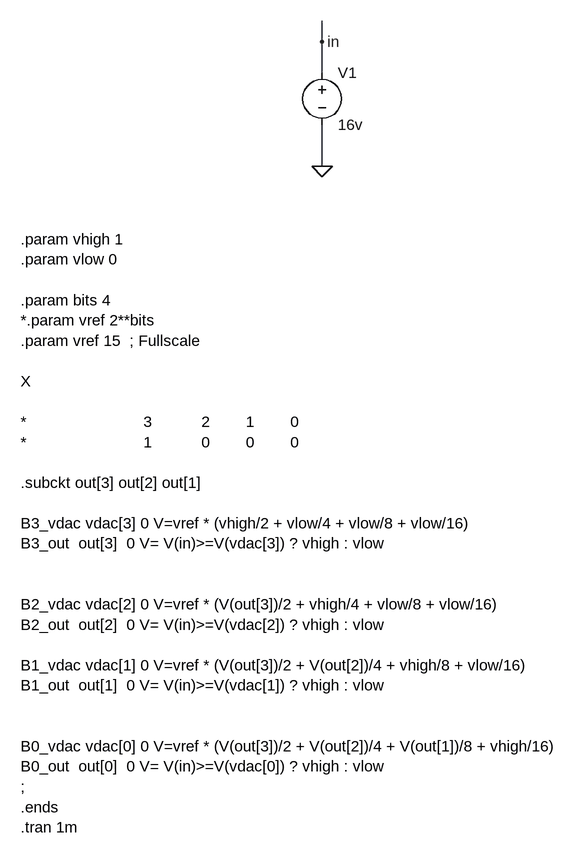
[diagram p0: schematic ADC_SAR_01.asc]
ADC_SAR_01.asc, the LTspice schematic file:
Version 4
SHEET 1 1004 1020
WIRE 496 -112 496 -144
WIRE 496 -64 496 -112
WIRE 496 80 496 16
FLAG 496 80 0
FLAG 496 -112 in
SYMBOL voltage 496 -80 R0
SYMATTR InstName V1
SYMATTR Value 16v
TEXT 32 192 Left 2 !.param vhigh 1\n.param vlow 0\n \n.param bits 4\n*.param vref 2**bits\n.param vref 15  ; Fullscale\n \nX\n \n*                          3           2        1        0\n*                          1           0        0        0\n \n.subckt out[3] out[2] out[1]\n \nB3_vdac vdac[3] 0 V=vref * (vhigh/2 + vlow/4 + vlow/8 + vlow/16)\nB3_out  out[3]  0 V= V(in)>=V(vdac[3]) ? vhigh : vlow\n \n \nB2_vdac vdac[2] 0 V=vref * (V(out[3])/2 + vhigh/4 + vlow/8 + vlow/16)\nB2_out  out[2]  0 V= V(in)>=V(vdac[2]) ? vhigh : vlow\n \nB1_vdac vdac[1] 0 V=vref * (V(out[3])/2 + V(out[2])/4 + vhigh/8 + vlow/16)\nB1_out  out[1]  0 V= V(in)>=V(vdac[1]) ? vhigh : vlow\n \n \nB0_vdac vdac[0] 0 V=vref * (V(out[3])/2 + V(out[2])/4 + V(out[1])/8 + vhigh/16)\nB0_out  out[0]  0 V= V(in)>=V(vdac[0]) ? vhigh : vlow\n; \n.ends \n.tran 1m

The netlist it stands for:
* ADC_SAR_01.asc
V1 in 0 16v
.param vhigh 1
.param vlow 0
.param bits 4
*.param vref 2**bits
.param vref 15  ; Fullscale
X
*                          3           2        1        0
*                          1           0        0        0
.subckt out[3] out[2] out[1]
B3_vdac vdac[3] 0 V=vref * (vhigh/2 + vlow/4 + vlow/8 + vlow/16)
B3_out  out[3]  0 V= V(in)>=V(vdac[3]) ? vhigh : vlow
B2_vdac vdac[2] 0 V=vref * (V(out[3])/2 + vhigh/4 + vlow/8 + vlow/16)
B2_out  out[2]  0 V= V(in)>=V(vdac[2]) ? vhigh : vlow
B1_vdac vdac[1] 0 V=vref * (V(out[3])/2 + V(out[2])/4 + vhigh/8 + vlow/16)
B1_out  out[1]  0 V= V(in)>=V(vdac[1]) ? vhigh : vlow
B0_vdac vdac[0] 0 V=vref * (V(out[3])/2 + V(out[2])/4 + V(out[1])/8 + vhigh/16)
B0_out  out[0]  0 V= V(in)>=V(vdac[0]) ? vhigh : vlow
;
.ends
.tran 1m
.backanno
.end